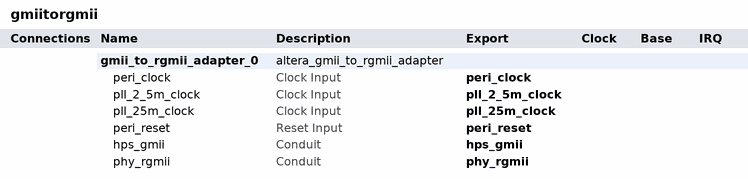
[diagram p0: system contents]
# Platform Designer (Qsys) system gmiitorgmii, Cyclone V 5CSXFC6C6U23C7
# Parameters at their usual value, and those the tool derives, are not listed.
package require -exact qsys 18.1
create_system gmiitorgmii
set_project_property DEVICE_FAMILY {Cyclone V}
set_project_property DEVICE 5CSXFC6C6U23C7

add_instance gmii_to_rgmii_adapter_0 altera_gmii_to_rgmii_adapter 18.1
set_instance_property gmii_to_rgmii_adapter_0 AUTO_EXPORT true
set_instance_parameter_value gmii_to_rgmii_adapter_0 RX_PIPELINE_DEPTH 0
set_instance_parameter_value gmii_to_rgmii_adapter_0 TX_PIPELINE_DEPTH 0

# exported interfaces
add_interface hps_gmii conduit end
set_interface_property hps_gmii EXPORT_OF gmii_to_rgmii_adapter_0.hps_gmii
add_interface peri_clock clock sink
set_interface_property peri_clock EXPORT_OF gmii_to_rgmii_adapter_0.peri_clock
add_interface peri_reset reset sink
set_interface_property peri_reset EXPORT_OF gmii_to_rgmii_adapter_0.peri_reset
add_interface phy_rgmii conduit end
set_interface_property phy_rgmii EXPORT_OF gmii_to_rgmii_adapter_0.phy_rgmii
add_interface pll_25m_clock clock sink
set_interface_property pll_25m_clock EXPORT_OF gmii_to_rgmii_adapter_0.pll_25m_clock
add_interface pll_2_5m_clock clock sink
set_interface_property pll_2_5m_clock EXPORT_OF gmii_to_rgmii_adapter_0.pll_2_5m_clock

set_interconnect_requirement {$system} qsys_mm.clockCrossingAdapter HANDSHAKE
set_interconnect_requirement {$system} qsys_mm.enableEccProtection FALSE
set_interconnect_requirement {$system} qsys_mm.insertDefaultSlave FALSE
set_interconnect_requirement {$system} qsys_mm.maxAdditionalLatency 1

save_system gmiitorgmii.qsys
